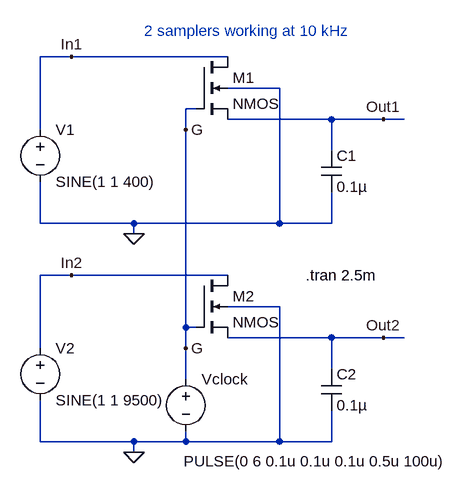
[diagram p0: schematic sampler.asc]
sampler.asc, the LTspice schematic file:
Version 4
SHEET 1 892 680
WIRE 96 -144 48 -144
WIRE 336 -144 96 -144
WIRE 416 -96 336 -96
WIRE 288 -64 272 -64
WIRE 496 -48 336 -48
WIRE 576 -48 496 -48
WIRE 608 -48 576 -48
WIRE 48 -32 48 -144
WIRE 272 -32 272 -64
WIRE 496 0 496 -48
WIRE 48 112 48 48
WIRE 192 112 48 112
WIRE 416 112 416 -96
WIRE 416 112 192 112
WIRE 496 112 496 64
WIRE 496 112 416 112
WIRE 192 128 192 112
WIRE 96 192 48 192
WIRE 336 192 96 192
WIRE 416 240 336 240
WIRE 272 272 272 -32
WIRE 288 272 272 272
WIRE 496 288 336 288
WIRE 576 288 496 288
WIRE 608 288 576 288
WIRE 48 304 48 192
WIRE 272 304 272 272
WIRE 496 336 496 288
WIRE 272 352 272 304
WIRE 48 448 48 384
WIRE 192 448 48 448
WIRE 272 448 272 432
WIRE 272 448 192 448
WIRE 416 448 416 240
WIRE 416 448 272 448
WIRE 496 448 496 400
WIRE 496 448 416 448
WIRE 192 464 192 448
FLAG 192 464 0
FLAG 576 288 Out2
FLAG 96 192 In2
FLAG 272 304 G
FLAG 192 128 0
FLAG 576 -48 Out1
FLAG 96 -144 In1
FLAG 272 -32 G
SYMBOL cap 480 336 R0
SYMATTR InstName C2
SYMATTR Value 0.1µ
SYMBOL voltage 48 288 R0
WINDOW 123 0 0 Left 2
WINDOW 39 0 0 Left 2
SYMATTR InstName V2
SYMATTR Value SINE(1 1 9500)
SYMBOL voltage 272 336 R0
WINDOW 3 -3 142 Left 2
WINDOW 123 0 0 Left 2
WINDOW 39 0 0 Left 2
SYMATTR InstName Vclock
SYMATTR Value PULSE(0 6 0.1u 0.1u 0.1u 0.5u 100u)
SYMBOL nmos4 288 192 R0
SYMATTR InstName M2
SYMATTR Value2 l=0.1u w=2000u
SYMBOL cap 480 0 R0
SYMATTR InstName C1
SYMATTR Value 0.1µ
SYMBOL voltage 48 -48 R0
WINDOW 123 0 0 Left 2
WINDOW 39 0 0 Left 2
SYMATTR InstName V1
SYMATTR Value SINE(1 1 400)
SYMBOL nmos4 288 -144 R0
SYMATTR InstName M1
SYMATTR Value2 l=0.1u w=2000u
TEXT 456 192 Left 2 !.tran 2.5m
TEXT 208 -184 Left 2 ;2 samplers working at 10 kHz

The netlist it stands for:
* sampler.asc
C2 Out2 0 0.1µ
V2 In2 0 SINE(1 1 9500)
Vclock G 0 PULSE(0 6 0.1u 0.1u 0.1u 0.5u 100u)
M2 In2 G Out2 0 NMOS l=0.1u w=2000u
C1 Out1 0 0.1µ
V1 In1 0 SINE(1 1 400)
M1 In1 G Out1 0 NMOS l=0.1u w=2000u
.model NMOS NMOS
.model PMOS PMOS
.lib standard.mos
.tran 2.5m
* 2 samplers working at 10 kHz
.backanno
.end